# EasyEDA Pro project emergency-button.epro

# Schematic Schematic1
Board Name: Board1; Create Date: 2025-12-01; Page Name: P1; Project Name: Emergency Button; Schematic Name: Schematic1; Update Date: 2025-12-01; Company: EasyEDA.com; Page Size: A4; Version: V1.0
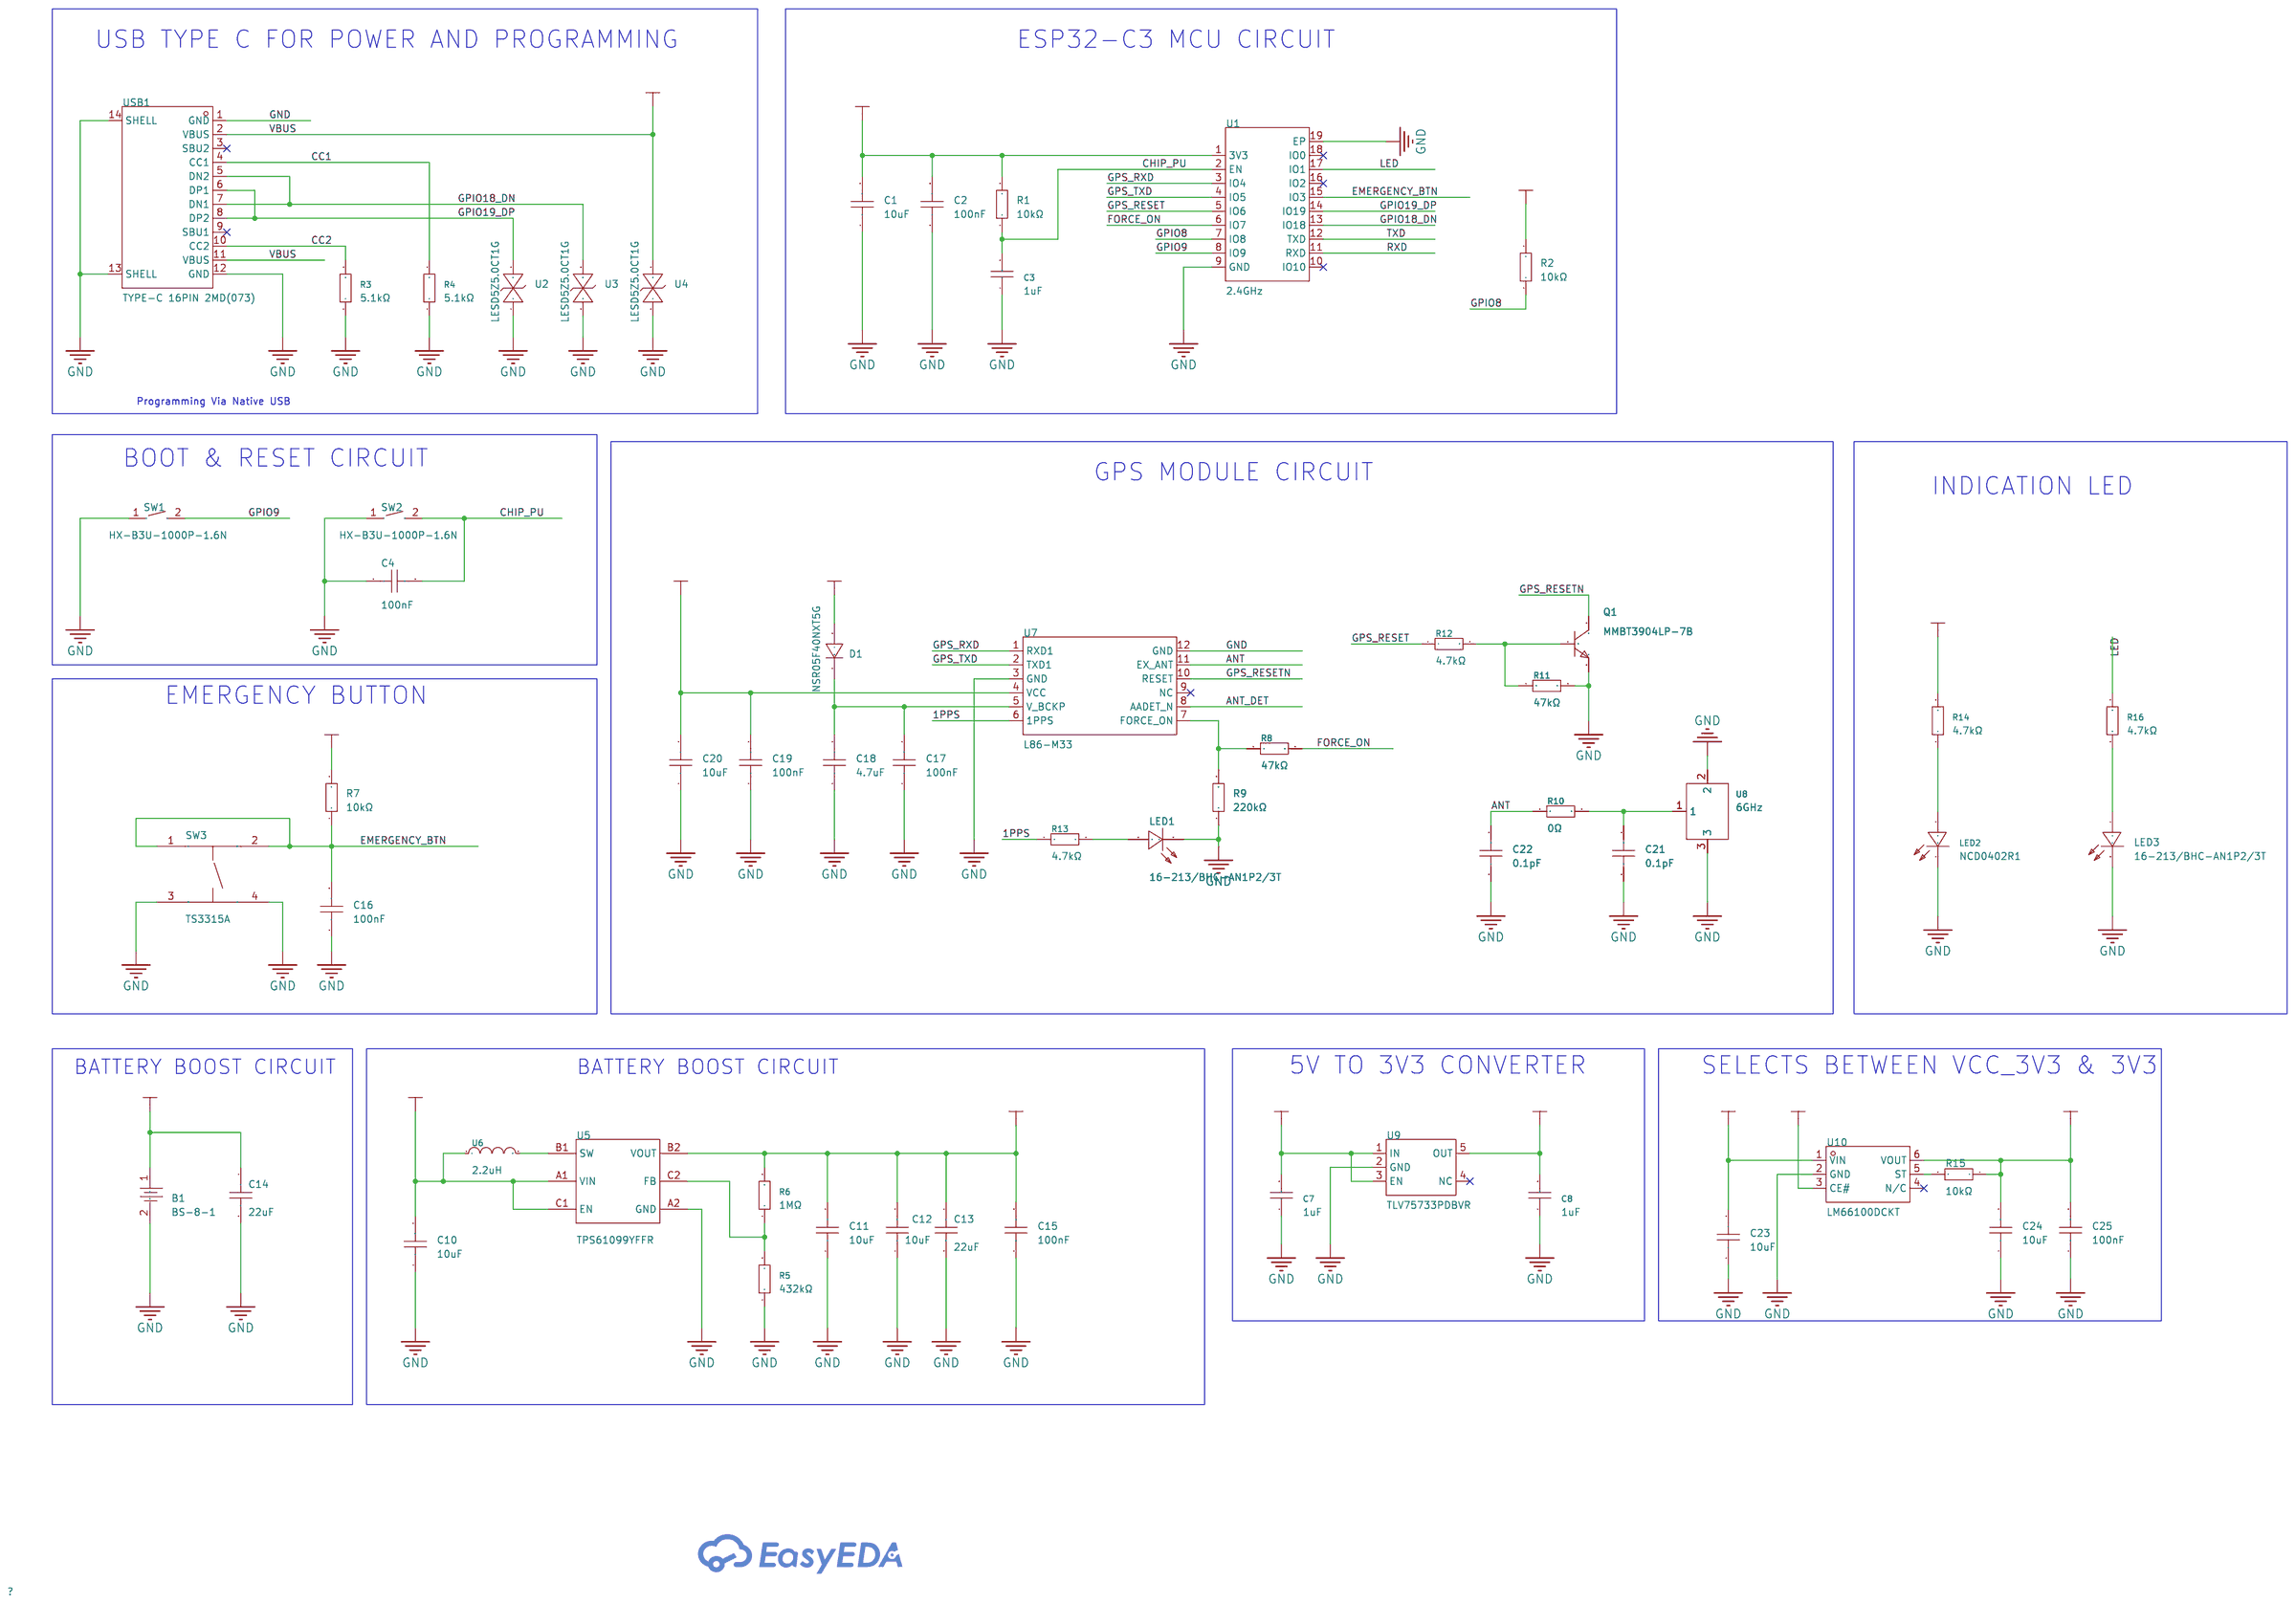
[diagram p0: schematic sheet]

## Parts
B1  BS-8-1  [BAT-TH_BS-8-1]
C1  10uF  [C0402]
C2  100nF  [C0402]
C3  1uF  [C0402]
C4  100nF  [C0402]
C7  1uF  [C0402]
C8  1uF  [C0402]
C10  10uF  [C0402]
C11  10uF  [C0402]
C12  10uF  [C0402]
C13  22uF  [C0603]
C14  22uF  [C0603]
C15  100nF  [C0402]
C16  100nF  [C0402]
C17  100nF  [C0402]
C18  4.7uF  [C0402]
C19  100nF  [C0402]
C20  10uF  [C0402]
C21  0.1pF  [C0402]
C22  0.1pF  [C0402]
C23  10uF  [C0402]
C24  10uF  [C0402]
C25  100nF  [C0402]
D1  NSR05F40NXT5G  [DSN2_L1.0-W0.6-RD]
LED1  16-213/BHC-AN1P2/3T  [LED0402-R-RD]
LED2  NCD0402R1  [LED0402-RD]
LED3  16-213/BHC-AN1P2/3T  [LED0402-R-RD]
Q1  MMBT3904LP-7B  [X1-DFN1006-3_L1.0-W0.6-BR]
R1  10kΩ  [R0402]
R2  10kΩ  [R0402]
R3  5.1kΩ  [R0402]
R4  5.1kΩ  [R0402]
R5  432kΩ  [R0402]
R6  1MΩ  [R0402]
R7  10kΩ  [R0402]
R8  47kΩ  [R0402]
R9  220kΩ  [R0402]
R10  0Ω  [R0402]
R11  47kΩ  [R0402]
R12  4.7kΩ  [R0402]
R13  4.7kΩ  [R0402]
R14  4.7kΩ  [R0402]
R15  10kΩ  [R0402]
R16  4.7kΩ  [R0402]
SW1  HX-B3U-1000P-1.6N  [SW-SMD_2P-L3.0-W2.5-LS4.0]
SW2  HX-B3U-1000P-1.6N  [SW-SMD_2P-L3.0-W2.5-LS4.0]
SW3  TS3315A  [SW-SMD_4P-L3.4-W3.4-P2.00-LS4.0]
U1  2.4GHz  [BULETM-SMD_ESPRESSIF_ESP32-C3-WROOM-02-N4-4MB]
U2  LESD5Z5.0CT1G  [SOD-523_L1.2-W0.8-LS1.6-BI]
U3  LESD5Z5.0CT1G  [SOD-523_L1.2-W0.8-LS1.6-BI]
U4  LESD5Z5.0CT1G  [SOD-523_L1.2-W0.8-LS1.6-BI]
U5  TPS61099YFFR  [DSBGA-6_L0.8-W1.2-P0.40-R3-C2-TL]
U6  2.2uH  [IND-SMD_L2.0-W1.6]
U7  L86-M33  [GPSM-SMD_12P-L16.0-W16.0-P2.54-BL]
U8  6GHz  [IPEX-SMD_BWIPX-1-001E]
U9  TLV75733PDBVR  [SOT-23-5_L2.9-W1.6-P0.95-LS2.8-BL]
U10  LM66100DCKT  [SC-70-6_L2.0-W1.3-P0.65-LS2.1-BL]
USB1  TYPE-C 16PIN 2MD(073)  [USB-C-SMD_TYPE-C-6PIN-2MD-073]

## Library data of the parts
B1 = BS-8-1: LCSC Part Name: 镀金 BS-8-1; Supplier Part: C70378; Manufacturer: QIJEY; Supplier Footprint: SMD; JLCPCB Part Class: Extended Part; Datasheet: https://item.szlcsc.com/datasheet/BS-8-1/71473.html; Supplier: LCSC
C1 C20 = CL05A106MP5NUNC_C315248: Capacitance:10uF Tolerance:±20% Tolerance:±20% Voltage Rating:10V Temperature Coefficient:X5R; LCSC Part Name: 10uF ±20% 10V; Supplier Part: C315248; Manufacturer: SAMSUNG(三星); Manufacturer Part: CL05A106MP5NUNC; Supplier Footprint: 0402; Datasheet: https://item.szlcsc.com/datasheet/CL05A106MP5NUNC/297154.html; Supplier: LCSC; Tolerance: ±20%; Voltage Rating: 10V; Temperature Coefficient: X5R
C2 C4 C15-C17 C19 C25 = CL05B104KB54PNC: Capacitance:100nF Tolerance:±10% Tolerance:±10% Voltage Rating:50V Temperature Coefficient:X7R; LCSC Part Name: 100nF ±10% 50V; Supplier Part: C307331; Manufacturer: SAMSUNG(三星); Supplier Footprint: 0402; Datasheet: https://item.szlcsc.com/datasheet/CL05B104KB54PNC/291005.html; Supplier: LCSC; Tolerance: ±10%; Voltage Rating: 50V; Temperature Coefficient: X7R
C3 C7 C8 = CL05A105KO5NNNC: Capacitance:1uF Tolerance:±10% Tolerance:±10% Voltage Rating:16V Temperature Coefficient:X5R; LCSC Part Name: 1uF ±10% 16V; Supplier Part: C29266; Manufacturer: SAMSUNG(三星); Supplier Footprint: 0402; Datasheet: https://item.szlcsc.com/datasheet/CL05A105KO5NNNC/30018.html; Supplier: LCSC; Tolerance: ±10%; Voltage Rating: 16V; Temperature Coefficient: X5R
C10-C12 C23 C24 = CL05A106MP5NUNC_C315248: Capacitance:10uF Tolerance:±20% Tolerance:±20% Voltage Rating:10V Temperature Coefficient:X5R; LCSC Part Name: 10uF ±20% 10V; Supplier Part: C315248; Manufacturer: SAMSUNG(三星); Manufacturer Part: CL05A106MP5NUNC; Supplier Footprint: 0402; JLCPCB Part Class: Extended Part; Datasheet: https://item.szlcsc.com/datasheet/CL05A106MP5NUNC/297154.html; Supplier: LCSC; Tolerance: ±20%; Voltage Rating: 10V; Temperature Coefficient: X5R
C13 C14 = CL10A226MO7JZNC: Capacitance:22uF Tolerance:±20% Tolerance:±20% Voltage Rating:16V Temperature Coefficient:X5R; LCSC Part Name: 22uF ±20% 16V; Supplier Part: C2762594; Manufacturer: SAMSUNG(三星); Supplier Footprint: 0603; Datasheet: https://item.szlcsc.com/datasheet/CL10A226MO7JZNC/2889856.html; Supplier: LCSC; Tolerance: ±20%; Voltage Rating: 16V; Temperature Coefficient: X5R
C18 = CL05A475MP5NRNC: Capacitance:4.7uF Tolerance:±20% Tolerance:±20% Voltage Rating:10V Temperature Coefficient:X5R; LCSC Part Name: 4.7uF ±20% 10V; Supplier Part: C23733; Manufacturer: SAMSUNG(三星); Supplier Footprint: 0402; Datasheet: https://item.szlcsc.com/datasheet/CL05A475MP5NRNC/24469.html; Supplier: LCSC; Tolerance: ±20%; Voltage Rating: 10V; Temperature Coefficient: X5R
C21 C22 = GJM1555C1HR10WB01D: Capacitance:0.1pF Voltage Rating:50V Temperature Coefficient:C0G; LCSC Part Name: ±0.05pF 0.1pF 50V; Supplier Part: C161338; Manufacturer: muRata(村田); Supplier Footprint: 0402; Datasheet: https://item.szlcsc.com/datasheet/GJM1555C1HR10WB01D/172719.html; Supplier: LCSC; Voltage Rating: 50V; Temperature Coefficient: C0G
D1 = NSR05F40NXT5G: Voltage - Forward(Vf@If):460mV@500mA Voltage - DC Reverse(Vr):40V Current - Rectified:500mA Reverse Leakage Current (Ir):75uA@40V Operating Junction Temperature Range:-40℃~+150℃ Operating Junction Temperature Range:-40℃~+150℃ Non-Repetitive Peak Forward S; LCSC Part Name: 电压:40V 电流:500mA; Supplier Part: C146713; Manufacturer: onsemi(安森美); Supplier Footprint: 0402; Datasheet: https://item.szlcsc.com/datasheet/NSR05F40NXT5G/158045.html; Supplier: LCSC; Voltage - Forward(Vf@If): 460mV@500mA; Voltage - DC Reverse(Vr): 40V; Current - Rectified: 500mA; Reverse Leakage Current (Ir): 75uA@40V; Operating Junction Temperature Range: -40℃~+150℃; Non-Repetitive Peak Forward Surge Current: 10A
LED1 LED3 = 16-213/BHC-AN1P2/3T: Illumination Color:Blue; LCSC Part Name: 蓝灯; Supplier Part: C131223; Manufacturer: EVERLIGHT(亿光); Supplier Footprint: 0402; Supplier: LCSC; Illumination Color: Blue
LED2 = NCD0402R1: Illumination Color:Red Voltage - Forward(Vf):1.6V~2.6V Voltage - Forward(Vf):1.6V~2.6V Power(Watts):65mW Forward Current:25mA Wavelength - Dominant:615nm~635nm Wavelength - Dominant:615nm~635nm Peak Wavelength:630nm Lens Color:- Luminous Intensity:30mcd L; LCSC Part Name: 片式发光二极管; Supplier Part: C130719; Manufacturer: 国星光电; Supplier Footprint: 0402; JLCPCB Part Class: Extended Part; Datasheet: https://item.szlcsc.com/datasheet/NCD0402R1/142008.html; Supplier: LCSC; Illumination Color: Red; Voltage - Forward(Vf): 1.6V~2.6V; Power(Watts): 65mW; Forward Current: 25mA; Wavelength - Dominant: 615nm~635nm; Peak Wavelength: 630nm; Luminous Intensity: 30mcd; Viewing Angle: 130°; Operating Temperature: -30℃~+85℃
Q1 = MMBT3904LP-7B: type:NPN Current - Collector(Ic):200mA Collector - Emitter Voltage VCEO:40V Pd - Power Dissipation:1W DC Current Gain:100@10mA,1.0V DC Current Gain:100@10mA,1.0V Transition frequency(fT):300MHz Current - Collector Cutoff:50nA Vce Saturation(VCE(sat)):300m; LCSC Part Name: NPN 电流:200mA 电压:40V; Supplier Part: C154763; Manufacturer: DIODES(美台); Supplier Footprint: DFN-3(1x0.6); Datasheet: https://item.szlcsc.com/datasheet/MMBT3904LP-7B/166105.html; Supplier: LCSC; type: NPN; Current - Collector(Ic): 200mA; Collector - Emitter Voltage VCEO: 40V; Pd - Power Dissipation: 1W; DC Current Gain: 100@10mA,1.0V; Transition frequency(fT): 300MHz; Current - Collector Cutoff: 50nA; Vce Saturation(VCE(sat)): 300mV@50mA,5mA; Operating Temperature: -55℃~+150℃; Emitter-Base Voltage(Vebo): 6V; Number: 1 NPN
R1 R2 R7 R15 = 0402WGF1002TCE: Type:Thick Film Resistor Resistance:10kΩ Tolerance:±1% Tolerance:±1% Power(Watts):62.5mW Voltage-Supply(Max):50V Temperature Coefficient:±100ppm/℃ Temperature Coefficient:±100ppm/℃ Operating Temperature:-55℃~+155℃ Operating Temperature:-55℃~+155℃; LCSC Part Name: 10kΩ ±1% 62.5mW 厚膜电阻; Supplier Part: C25744; Manufacturer: UNI-ROYAL(厚声); Supplier Footprint: 0402; Datasheet: https://item.szlcsc.com/datasheet/0402WGF1002TCE/26487.html; Supplier: LCSC; Type: Thick Film Resistor; Tolerance: ±1%; Power(Watts): 62.5mW; Voltage-Supply(Max): 50V; Temperature Coefficient: ±100ppm/℃; Operating Temperature: -55℃~+155℃
R3 R4 = 0402WGF5101TCE: Type:Thick Film Resistor Resistance:5.1kΩ Tolerance:±1% Tolerance:±1% Power(Watts):62.5mW Voltage-Supply(Max):50V Temperature Coefficient:±100ppm/℃ Temperature Coefficient:±100ppm/℃ Operating Temperature:-55℃~+155℃ Operating Temperature:-55℃~+155℃; LCSC Part Name: 5.1kΩ ±1% 62.5mW 厚膜电阻; Supplier Part: C25905; Manufacturer: UNI-ROYAL(厚声); Supplier Footprint: 0402; Datasheet: https://item.szlcsc.com/datasheet/0402WGF5101TCE/26648.html; Supplier: LCSC; Type: Thick Film Resistor; Tolerance: ±1%; Power(Watts): 62.5mW; Voltage-Supply(Max): 50V; Temperature Coefficient: ±100ppm/℃; Operating Temperature: -55℃~+155℃
R5 = 0402WGF4323TCE: Type:Thick Film Resistors Resistance:432kΩ Tolerance:±1% Tolerance:±1% Power(Watts): Overload Voltage (Max): Temperature Coefficient:±100ppm/℃ Temperature Coefficient:±100ppm/℃ Operating Temperature Range:-55℃~+155℃ Operating Temperature Range:-55℃~+155℃; LCSC Part Name: 432kΩ ±1% 62.5mW 厚膜电阻; Supplier Part: C25787; Manufacturer: UNI-ROYAL(厚声); Supplier Footprint: 0402; Datasheet: https://atta.szlcsc.com/upload/public/pdf/source/20200306/C422600_1E6D84923E4A46A82E41ADD87F860B5C.pdf; Supplier: LCSC; Type: Thick Film Resistors; Tolerance: ±1%; Temperature Coefficient: ±100ppm/℃; Operating Temperature Range: -55℃~+155℃
R6 = 0402WGF1004TCE: Type:Thick Film Resistor Resistance:1MΩ Tolerance:±1% Tolerance:±1% Power(Watts):62.5mW Voltage-Supply(Max):50V Temperature Coefficient:±100ppm/℃ Temperature Coefficient:±100ppm/℃ Operating Temperature:-55℃~+155℃ Operating Temperature:-55℃~+155℃; LCSC Part Name: 1MΩ ±1% 62.5mW 厚膜电阻; Supplier Part: C26083; Manufacturer: UNI-ROYAL(厚声); Supplier Footprint: 0402; Datasheet: https://item.szlcsc.com/datasheet/0402WGF1004TCE/26826.html; Supplier: LCSC; Type: Thick Film Resistor; Tolerance: ±1%; Power(Watts): 62.5mW; Voltage-Supply(Max): 50V; Temperature Coefficient: ±100ppm/℃; Operating Temperature: -55℃~+155℃
R8 R11 = 0402WGJ0473TCE: Type:Thick Film Resistors Resistance:47kΩ Tolerance:±5% Tolerance:±5% Power(Watts): Overload Voltage (Max): Temperature Coefficient:±100ppm/℃ Temperature Coefficient:±100ppm/℃ Operating Temperature Range:-55℃~+155℃ Operating Temperature Range:-55℃~+155℃; LCSC Part Name: 47kΩ ±5% 62.5mW 厚膜电阻; Supplier Part: C25563; Manufacturer: UNI-ROYAL(厚声); Supplier Footprint: 0402; Datasheet: https://atta.szlcsc.com/upload/public/pdf/source/20200306/C422600_1E6D84923E4A46A82E41ADD87F860B5C.pdf; Supplier: LCSC; Type: Thick Film Resistors; Tolerance: ±5%; Temperature Coefficient: ±100ppm/℃; Operating Temperature Range: -55℃~+155℃
R9 = 0402WGF2203TCE: Type:Thick Film Resistor Resistance:220kΩ Tolerance:±1% Tolerance:±1% Power(Watts):62.5mW Voltage-Supply(Max):50V Temperature Coefficient:±100ppm/℃ Temperature Coefficient:±100ppm/℃ Operating Temperature:-55℃~+155℃ Operating Temperature:-55℃~+155℃; LCSC Part Name: 220kΩ ±1% 62.5mW 厚膜电阻; Supplier Part: C25767; Manufacturer: UNI-ROYAL(厚声); Supplier Footprint: 0402; Datasheet: https://item.szlcsc.com/datasheet/0402WGF2203TCE/26510.html; Supplier: LCSC; Type: Thick Film Resistor; Tolerance: ±1%; Power(Watts): 62.5mW; Voltage-Supply(Max): 50V; Temperature Coefficient: ±100ppm/℃; Operating Temperature: -55℃~+155℃
R10 = 0402WGF0000TCE: Type:Thick Film Resistor Resistance:0Ω Tolerance:±1% Tolerance:±1% Power(Watts):62.5mW Voltage-Supply(Max):50V Temperature Coefficient:±800ppm/℃ Temperature Coefficient:±800ppm/℃ Operating Temperature:-55℃~+155℃ Operating Temperature:-55℃~+155℃; LCSC Part Name: 0Ω ±1% 62.5mW 厚膜电阻; Supplier Part: C17168; Manufacturer: UNI-ROYAL(厚声); Supplier Footprint: 0402; JLCPCB Part Class: Basic Part; Datasheet: https://item.szlcsc.com/datasheet/0402WGF0000TCE/17853.html; Supplier: LCSC; Type: Thick Film Resistor; Tolerance: ±1%; Power(Watts): 62.5mW; Voltage-Supply(Max): 50V; Temperature Coefficient: ±800ppm/℃; Operating Temperature: -55℃~+155℃
R12-R14 R16 = 0402WGF4701TCE: Type:Thick Film Resistor Resistance:4.7kΩ Tolerance:±1% Tolerance:±1% Power(Watts):62.5mW Voltage-Supply(Max):50V Temperature Coefficient:±100ppm/℃ Temperature Coefficient:±100ppm/℃ Operating Temperature:-55℃~+155℃ Operating Temperature:-55℃~+155℃; LCSC Part Name: 4.7kΩ ±1% 62.5mW 厚膜电阻; Supplier Part: C25900; Manufacturer: UNI-ROYAL(厚声); Supplier Footprint: 0402; Datasheet: https://item.szlcsc.com/datasheet/0402WGF4701TCE/26643.html; Supplier: LCSC; Type: Thick Film Resistor; Tolerance: ±1%; Power(Watts): 62.5mW; Voltage-Supply(Max): 50V; Temperature Coefficient: ±100ppm/℃; Operating Temperature: -55℃~+155℃
SW1 SW2 = HX-B3U-1000P-1.6N: Circuit:SPST Actuator Style:Round Button Operating Force:1.6N Mounting Type:Surface Mount,Vertical Length:3mm Width:2.5mm Switch Height:1.5mm with Bracket:Without Bracket Contact Current:50mA Voltage Rating:12V Actuator/Cap Color:Black With Lamp:No IP Rat; LCSC Part Name: 3*2.5*1.6mm 立贴 轻触开关; Supplier Part: C49234121; Manufacturer: hanxia(韩下); Supplier Footprint: SMD; Datasheet: https://item.szlcsc.com/datasheet/HX-B3U-1000P-1.6N/51650182.html; Supplier: LCSC; Circuit: SPST; Actuator Style: Round Button; Operating Force: 1.6N; Mounting Type: Surface Mount,Vertical; Length: 3mm; Width: 2.5mm; Switch Height: 1.5mm; with Bracket: Without Bracket; Contact Current: 50mA; Voltage Rating: 12V; Actuator/Cap Color: Black; With Lamp: No; Termination Style: SMD(SMT) Tab; Life: 100,000 Cycles
SW3 = TS3315A: Circuit:SPST Actuator Style:Round Button Operating Force:2.5N Mounting Type:Surface Mount,Vertical Length:3.3mm Width:3.3mm Switch Height:1.5mm with Bracket:- Contact Current:50mA Voltage Rating:12V Actuator/Cap Color:- With Lamp:- IP Rating:- Termination; LCSC Part Name: 3.3*3.3*1.5mm 立贴 轻触开关; Supplier Part: C412367; Manufacturer: SHOU HAN(首韩); Supplier Footprint: SMD,3.3x3.3mm; Datasheet: https://item.szlcsc.com/datasheet/TS3315A/404079.html; Supplier: LCSC; Circuit: SPST; Actuator Style: Round Button; Operating Force: 2.5N; Mounting Type: Surface Mount,Vertical; Length: 3.3mm; Width: 3.3mm; Switch Height: 1.5mm; Contact Current: 50mA; Voltage Rating: 12V; Life: 50,000 Cycles; Operating Temperature: -20℃~+70℃
U1 = ESP32-C3-WROOM-02-N4_C2934560: Core Processor:ESP32-C3芯片 Support Interface:I2C；GPIO；SPI；JTAG；UART；USB；I2S Frequency:2.4GHz Output Power:20.5dBm Output Power:20.5dBm; LCSC Part Name: ESP32-C3-WROOM-02-N4; Supplier Part: C2934560; Manufacturer: ESPRESSIF(乐鑫); Manufacturer Part: ESP32-C3-WROOM-02-N4; Supplier Footprint: VFQFN-32-EP; JLCPCB Part Class: Extended Part; Datasheet: https://atta.szlcsc.com/upload/public/pdf/source/20220106/F07459EFFE1D7CBA94B4FB8A075146A6.pdf; Supplier: LCSC; Core Processor: ESP32-C3芯片; Support Interface: I2C；GPIO；SPI；JTAG；UART；USB；I2S; Output Power: 20.5dBm
U2-U4 = LESD5Z5.0CT1G_C5451650: polarity:Bidirectional Reverse Stand-Off Voltage (Vrwm):5V Maximum Clamping Voltage:11.6V Peak Pulse Current (Ipp):9A Breakdown Voltage:7.8V Number of Lines:Single channel Type:ESD; LCSC Part Name: 5V 15PF 双向; Supplier Part: C5451650; Manufacturer: HXY MOSFET(华轩阳电子); Supplier Footprint: SOD-523; Datasheet: https://atta.szlcsc.com/upload/public/pdf/source/20230427/2F645B9D698C2F305680EBFB223778D0.pdf; Supplier: LCSC; polarity: Bidirectional; Reverse Stand-Off Voltage (Vrwm): 5V; Maximum Clamping Voltage: 11.6V; Peak Pulse Current (Ipp): 9A; Breakdown Voltage: 7.8V; Number of Lines: Single channel; Type: ESD
U5 = TPS61099YFFR: Function:Boost type Output Type:Adjustable Input Voltage:700mV~5.5V Input Voltage:700mV~5.5V Output Voltage:1.8V~5.5V Output Voltage:1.8V~5.5V Output Current:800mA Operating Temperature:-40℃~+125℃@(TJ) Operating Temperature:-40℃~+125℃@(TJ) Synchronous Rec; LCSC Part Name: TPS61099x超低静态电流同步升压转换器; Supplier Part: C91091; Manufacturer: TI(德州仪器); Supplier Footprint: DSBGA-6; Datasheet: https://www.ti.com/cn/lit/gpn/tps61099; Supplier: LCSC; Function: Boost type; Output Type: Adjustable; Input Voltage: 700mV~5.5V; Output Voltage: 1.8V~5.5V; Output Current: 800mA; Operating Temperature: -40℃~+125℃@(TJ); Synchronous Rectification: Yes; Number of Outputs: 1; Topology: Boost; Switch tube (built-in/external): Built-in
U6 = VLS201610CX-2R2M-1: Inductance:2.2uH Tolerance:±20% Tolerance:±20% Current Rating:1.31A Current - Saturation(Isat):1.31A DC Resistance(DCR):136mΩ Ratings:-; LCSC Part Name: 2.2uH ±20% 1.31A; Supplier Part: C2041554; Manufacturer: TDK; Supplier Footprint: 0806; JLCPCB Part Class: Extended Part; Datasheet: https://item.szlcsc.com/datasheet/VLS201610CX-2R2M-1/2133117.html; Supplier: LCSC; Tolerance: ±20%; Current Rating: 1.31A; Current - Saturation(Isat): 1.31A; DC Resistance(DCR): 136mΩ
U7 = L86-M33: Voltage - Supply:3V~4.3V Voltage - Supply:3V~4.3V Sensitivity:-167dBm Sensitivity:-167dBm Operating Temperature:-40℃~+85℃ Operating Temperature:-40℃~+85℃; LCSC Part Name: 超紧凑的GNSS POT模块; Supplier Part: C909689; Manufacturer: Quectel(移远); Supplier Footprint: SMD-12P; JLCPCB Part Class: Extended Part; Datasheet: https://item.szlcsc.com/datasheet/L86-M33/976784.html; Supplier: LCSC; Voltage - Supply: 3V~4.3V; Sensitivity: -167dBm; Operating Temperature: -40℃~+85℃
U8 = BWU.FL-IPEX1: Connector Type:Board Side Interface:Male Pin Number of Ports:1 Interface Diameter:2mm Interface Length/Height:1.25mm Frequency:6GHz RF Series:IPEX Impedance:50Ω Style:- Operating Temperature Range:- Operating Temperature Range:-; LCSC Part Name: 内针 IPEX; Supplier Part: C5137195; Manufacturer: BAT WIRELESS(蝙蝠无线); Supplier Footprint: SMD; Datasheet: https://item.szlcsc.com/datasheet/BWU.FL-IPEX1/5745892.html; Supplier: LCSC; Connector Type: Board Side; Interface: Male Pin; Number of Ports: 1; Interface Diameter: 2mm; Interface Length/Height: 1.25mm; RF Series: IPEX; Impedance: 50Ω
U9 = TLV75733PDBVR: Output Type:Fixed Maximum Input Voltage:5.5V Output Voltage:3.3V Output Voltage:3.3V Output Current:1A Power Supply Rejection Ratio (PSRR):52dB Dropout Voltage:475mV@(1A) Feature:ESD Protection；Surge Protection；Low ESR；Thermal Protection(TSD)；Under-voltag; LCSC Part Name: 具有使能功能的 1A、低 IQ、高精度、低压降稳压器; Supplier Part: C485517; Manufacturer: TI(德州仪器); Supplier Footprint: SOT-23-5; JLCPCB Part Class: Extended Part; Datasheet: https://www.ti.com/cn/lit/gpn/tlv757p; Supplier: LCSC; Output Type: Fixed; Maximum Input Voltage: 5.5V; Output Voltage: 3.3V; Output Current: 1A; Power Supply Rejection Ratio (PSRR): 52dB; Dropout Voltage: 475mV@(1A); Feature: ESD Protection；Surge Protection；Low ESR；Thermal Protection(TSD)；Under-voltage Lockout；Overcurrent Protection(OCP)；With ability; Operating Temperature: -40℃~+125℃@(Tj); Output Polarity: Positive electrode; Number of Outputs: 1
U10 = LM66100DCKT_C2832141: Maximum Continuous Current:1.5A Voltage - Supply:1.5V~5.5V Voltage - Supply:1.5V~5.5V Operating Temperature	-:-40℃~+105℃ Operating Temperature	-:-40℃~+105℃; Supplier Part: C2832141; Manufacturer: TI(德州仪器); Supplier Footprint: SC-70-6; JLCPCB Part Class: Extended Part; Datasheet: https://www.ti.com/cn/lit/gpn/lm66100; Supplier: LCSC; Maximum Continuous Current: 1.5A; Voltage - Supply: 1.5V~5.5V; Operating Temperature	-: -40℃~+105℃
USB1 = TYPE-C 16PIN 2MD(073): Connector Type:Type-C Protocol Standard:- Gender:Female Mounting Type:Surface Mount, Right Angle Number of Contacts:16P Number of Ports:1 Current Rating-Power:3A Voltage Rating:5V Connect-Disconnect Life:5,000 Cycles Supplementary Features:- Center Height; LCSC Part Name: Type-C 母 卧贴; Supplier Part: C2765186; Manufacturer: SHOU HAN(首韩); Supplier Footprint: SMD; JLCPCB Part Class: Extended Part; Datasheet: https://item.szlcsc.com/datasheet/TYPE-C%252016PIN%25202MD(073)/2901843.html; Supplier: LCSC; Connector Type: Type-C; Gender: Female; Mounting Type: Surface Mount, Right Angle; Number of Contacts: 16P; Number of Ports: 1; Current Rating-Power: 3A; Voltage Rating: 5V; Connect-Disconnect Life: 5,000 Cycles; Detection color: Black; Operating Temperature: -25℃~+85℃

## Nets
3V3: C1.2 C2.2 C11.2 C12.2 C13.1 C15.2 C19.2 C20.2 C24.2 C25.2 D1.2(A) R1.2 R2.2 R6.2 R7.2 R15.1 U1.1(3V3) U5.B2(VOUT) U7.4(VCC) U10.3(CE#) U10.6(VOUT)
GND: B1.2 C1.1 C2.1 C3.1 C4.1 C7.1 C8.1 C10.1 C11.1 C12.1 C13.2 C14.2 C15.1 C16.1 C17.1 C18.1 C19.1 C20.1 C21.2 C22.2 C23.1 C24.1 C25.1 LED1.2(K) LED2.1(K) LED3.2(K) Q1.2(E) R3.1 R4.1 R5.1 R9.1 R11.2 SW1.1 SW2.1 SW3.3(C) SW3.4(D) U1.9(GND) U1.19(EP) U2.1 U3.1 U4.1 U5.A2(GND) U7.3(GND) U7.12(GND) U8.2 U8.3 U9.2(GND) U10.2(GND) USB1.1(GND) USB1.12(GND) USB1.13(SHELL) USB1.14(SHELL)
VBUS: C7.2 R14.2 U4.2 U9.1(IN) U9.3(EN) USB1.2(VBUS) USB1.11(VBUS)
VCC_3V3: C8.2 C23.2 U9.5(OUT) U10.1(VIN)
1PPS: R13.1 U7.6(1PPS)
ANT: C22.1 R10.1 U7.11(EX_ANT)
ANT_DET: U7.8(AADET_N)
BAT+: B1.1 C10.2 C14.1 U5.A1(VIN) U5.C1(EN) U6.1
CC1: R4.2 USB1.4(CC1)
CC2: R3.2 USB1.10(CC2)
CHIP_PU: C3.2 C4.2 R1.1 SW2.2 U1.2(EN)
EMERGENCY_BTN: C16.2 R7.1 SW3.1(A) SW3.2(B) U1.15(IO3)
FORCE_ON: R8.2 U1.6(IO7)
GPIO8: R2.1 U1.7(IO8)
GPIO9: SW1.2 U1.8(IO9)
GPIO18_DN: U1.13(IO18) U3.2 USB1.5(DN2) USB1.7(DN1)
GPIO19_DP: U1.14(IO19) U2.2 USB1.6(DP1) USB1.8(DP2)
GPS_RESET: R12.1 U1.5(IO6)
GPS_RESETN: Q1.3(C) U7.10(RESET)
GPS_RXD: U1.3(IO4) U7.1(RXD1)
GPS_TXD: U1.4(IO5) U7.2(TXD1)
LED: R16.1 U1.17(IO1)
RXD: U1.11(RXD)
TXD: U1.12(TXD)
$1N1386: R5.2 R6.1 U5.C2(FB)
$1N1393: U5.B1(SW) U6.2
$1N2307: C17.2 C18.2 D1.1(C) U7.5(V_BCKP)
$1N2753: R8.1 R9.2 U7.7(FORCE_ON)
$1N3030: C21.1 R10.2 U8.1
$1N3469: Q1.1(B) R11.1 R12.2
$1N3602: LED1.1(A) R13.2
$1N4272: R15.2 U10.5(ST)
$1N4446: LED2.2(A) R14.1
$1N4523: LED3.1(A) R16.2

Not connected (* = marked no-connect by the designer): U1 10(IO10)* 16(IO2)* 18(IO0)*; U7 9(NC)*; U9 4(NC)*; U10 4(N/C)*; USB1 3(SBU2)* 9(SBU1)*

## Notes on the sheet
- USB TYPE C FOR POWER AND PROGRAMMING
- ESP32-C3 MCU CIRCUIT
- Programming Via Native USB
- BOOT & RESET CIRCUIT
- GPS MODULE CIRCUIT
- INDICATION LED
- EMERGENCY BUTTON
- BATTERY BOOST CIRCUIT
- BATTERY BOOST CIRCUIT
- 5V TO 3V3 CONVERTER
- SELECTS BETWEEN VCC_3V3 & 3V3

# Board PCB1
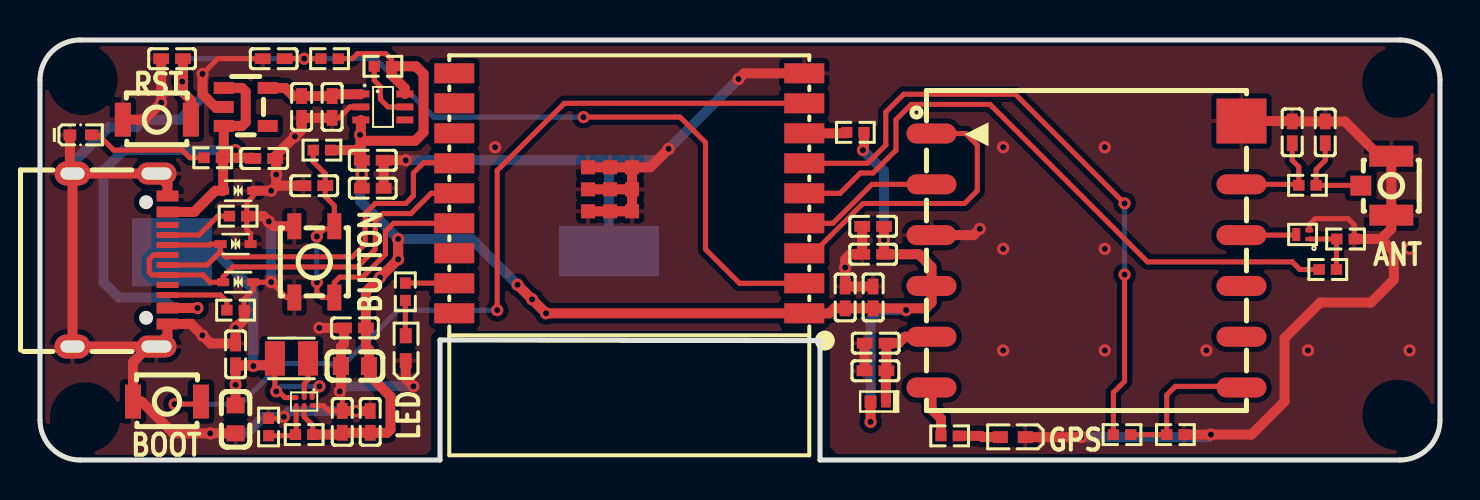
[diagram p1: board, top side]
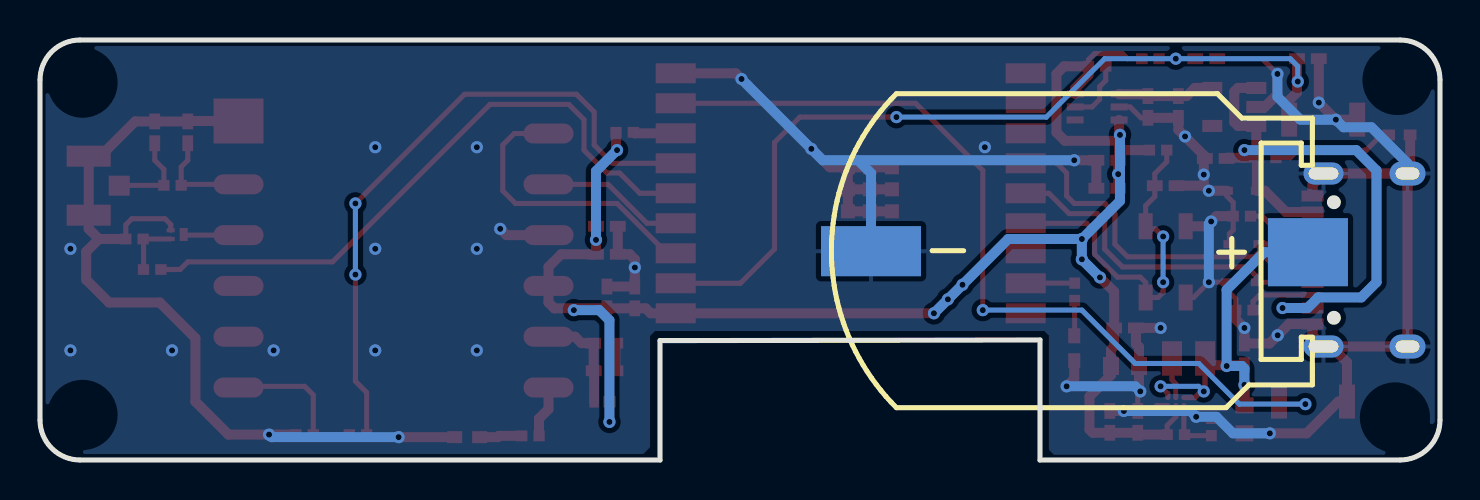
[diagram p2: board, bottom side, seen from below]

Outline 70 x 21 mm; copper layers: Top Layer, Bottom Layer. Coordinates in mm from the lower left corner of the outline.
Outline path: 0,19 0,2 arc(0.59,0.59) 2,0 20,0 20,6 39,5.97 39,0 68,0 arc(69.41,0.59) 70,2 70,19 arc(69.42,20.41) 68,21 2,21 arc(0.59,20.41) 0,19
Stack: Top Layer 0.035mm / Dielectric1 1.51mm FR4 er 4.5 / Bottom Layer 0.035mm

## Design rules (mm)
template: JLCPCB Capability(Two Layers Board)
spacing copperThickness1oz (default): track to track 0.102, other pairs 0.152 to 0.3
spacing copperThickness2oz: track to track 0.203, other pairs 0.152 to 0.3
track width copperThickness1oz (default): min 0.127, default 0.254, max 2.54
track width copperThickness2oz: min 0.203, default 0.254, max 2.54
differential pair differentialPair (default): width min 0.127, default 0.254, max 2.54; gap min 0.152, default 0.152
via viaSize (default): diameter min 0.5, default 0.61, max 10; hole min 0.3, default 0.305, max 6.3

## Placement (name value [footprint] x y rotation side)
B1  BS-8-1  [BAT-TH_BS-8-1]  17.53 10.41 0 bottom
C1  10uF  [C0402]  41.66 8.13 270 top
C2  100nF  [C0402]  40.26 8.13 270 top
C3  1uF  [C0402]  11.68 20.07 0 top
C4  100nF  [C0402]  6.6 20.07 0 top
C7  1uF  [C0402]  11.21 15.08 180 top
C8  1uF  [C0402]  13.08 17.65 90 top
C10  10uF  [C0402]  9.78 5.28 270 top
C11  10uF  [C0402]  15.11 1.91 270 top
C12  10uF  [C0402]  16.51 1.91 270 top
C13  22uF  [C0603]  15.75 4.7 180 top
C14  22uF  [C0603]  9.78 2.03 270 top
C15  100nF  [C0402]  15.75 6.6 0 top
C16  100nF  [C0402]  13.72 13.72 0 top
C17  100nF  [C0402]  41.77 4.46 0 top
C18  4.7uF  [C0402]  41.78 5.84 0 top
C19  100nF  [C0402]  41.66 11.68 0 top
C20  10uF  [C0402]  41.66 10.29 0 top
C21  0.1pF  [C0402]  64.26 16.38 90 top
C22  0.1pF  [C0402]  62.61 16.38 90 top
C23  10uF  [C0402]  14.61 17.65 90 top
C24  10uF  [C0402]  16.64 14.99 180 top
C25  100nF  [C0402]  16.64 13.59 180 top
D1  NSR05F40NXT5G  [DSN2_L1.0-W0.6-RD]  41.91 2.92 180 top
LED1  16-213/BHC-AN1P2/3T  [LED0402-R-RD]  48.64 1.14 180 top
LED2  NCD0402R1  [LED0402-RD]  2.03 16.26 0 top
LED3  16-213/BHC-AN1P2/3T  [LED0402-R-RD]  18.29 5.59 90 top
Q1  MMBT3904LP-7B  [X1-DFN1006-3_L1.0-W0.6-BR]  63.14 11.27 0 top
R1  10kΩ  [R0402]  14.48 20.07 0 top
R2  10kΩ  [R0402]  40.77 16.38 0 top
R3  5.1kΩ  [R0402]  9.78 7.49 180 top
R4  5.1kΩ  [R0402]  9.91 12.19 180 top
R5  432kΩ  [R0402]  11.43 1.65 270 top
R6  1MΩ  [R0402]  13.21 1.27 0 top
R7  10kΩ  [R0402]  14.1 15.49 0 top
R8  47kΩ  [R0402]  54.1 1.27 180 top
R9  220kΩ  [R0402]  56.77 1.27 180 top
R10  0Ω  [R0402]  63.37 13.73 0 top
R11  47kΩ  [R0402]  65.28 11.05 0 top
R12  4.7kΩ  [R0402]  64.39 9.53 0 top
R13  4.7kΩ  [R0402]  45.48 1.2 0 top
R14  4.7kΩ  [R0402]  8.64 15.11 0 top
R15  10kΩ  [R0402]  17.14 19.69 180 top
R16  4.7kΩ  [R0402]  18.27 8.41 270 top
SW1  HX-B3U-1000P-1.6N  [SW-SMD_2P-L3.0-W2.5-LS4.0]  6.35 2.92 180 top
SW2  HX-B3U-1000P-1.6N  [SW-SMD_2P-L3.0-W2.5-LS4.0]  5.84 17.02 180 top
SW3  TS3315A  [SW-SMD_4P-L3.4-W3.4-P2.00-LS4.0]  13.72 9.91 270 top
U1  2.4GHz  [BULETM-SMD_ESPRESSIF_ESP32-C3-WROOM-02-N4-4MB]  29.46 13.33 180 top
U2  LESD5Z5.0CT1G  [SOD-523_L1.2-W0.8-LS1.6-BI]  9.91 8.89 180 top
U3  LESD5Z5.0CT1G  [SOD-523_L1.2-W0.8-LS1.6-BI]  9.78 10.8 180 top
U4  LESD5Z5.0CT1G  [SOD-523_L1.2-W0.8-LS1.6-BI]  9.91 13.46 180 top
U5  TPS61099YFFR  [DSBGA-6_L0.8-W1.2-P0.40-R3-C2-TL]  13.21 2.92 270 top
U6  2.2uH  [IND-SMD_L2.0-W1.6]  12.57 5.08 180 top
U7  L86-M33  [GPSM-SMD_12P-L16.0-W16.0-P2.54-BL]  52.32 10.29 270 top
U8  6GHz  [IPEX-SMD_BWIPX-1-001E]  66.8 13.72 0 top
U9  TLV75733PDBVR  [SOT-23-5_L2.9-W1.6-P0.95-LS2.8-BL]  10.29 17.65 270 top
U10  LM66100DCKT  [SC-70-6_L2.0-W1.3-P0.65-LS2.1-BL]  17.14 17.65 270 top
USB1  TYPE-C 16PIN 2MD(073)  [USB-C-SMD_TYPE-C-6PIN-2MD-073]  4 10 270 top

## Footprints (pads in the part's own frame, mm; a bottom-side part is the same pattern mirrored in y, then rotated)
BAT-TH_BS-8-1
  rect 4x3.4 smd: 1(-10.922,0.025)
  rect 5x2.5 smd: 2(10.922,-0.025)
BULETM-SMD_ESPRESSIF_ESP32-C3-WROOM-02-N4-4MB
  rect 2x1 smd: 1(-8.75,6) 2(-8.75,4.5) 3(-8.75,3) 4(-8.75,1.5) 5(-8.75,0) 6(-8.75,-1.5) 7(-8.75,-3) 8(-8.75,-4.5) 9(-8.75,-6) 10(8.75,-6) 11(8.75,-4.5) 12(8.75,-3) 13(8.75,-1.5) 14(8.75,0) 15(8.75,1.5) 16(8.75,3) 17(8.75,4.5) 18(8.75,6)
  rect 0.7x0.7 smd: 19(-0.14,0.9) 19(-0.14,-0.2) 19(-0.14,-1.3) 19(0.96,0.9) 19(0.96,-0.2) 19(0.96,-1.3) 19(2.06,0.9) 19(2.06,-0.2) 19(2.06,-1.3)
C0402
  rect 0.79x0.54 smd: 1(-0.545,0) 2(0.545,0)
C0603
  rect 0.8x0.9 smd: 1(-0.7,0) 2(0.7,0)
DSBGA-6_L0.8-W1.2-P0.40-R3-C2-TL
  round 0.2 smd: A1(-0.201,0.4) A2(0.201,0.4) B1(-0.201,0.002) B2(0.201,-0.002) C1(-0.201,-0.4) C2(0.201,-0.4)
DSN2_L1.0-W0.6-RD
  rect 0.47x0.6 smd: 1(-0.383,0)
  rect 0.6x0.6 smd: 2(0.383,0)
GPSM-SMD_12P-L16.0-W16.0-P2.54-BL
  oval 1x2.5 smd: 1(-6.037,-7.75) 2(-3.498,-7.75) 3(-0.958,-7.75) 4(1.583,-7.75) 5(4.122,-7.75) 6(6.662,-7.75) 7(6.662,7.75) 8(4.122,7.75) 9(1.583,7.75) 10(-0.958,7.75) 11(-3.498,7.75)
  rect 2.25x2.5 smd: 12(-6.662,7.75)
IND-SMD_L2.0-W1.6
  rect 1x1.72 smd: 1(0.828,0) 2(-0.828,0)
IPEX-SMD_BWIPX-1-001E
  rect 1.05x1 smd: 1(-0.762,0)
  rect 2.2x1.05 smd: 2(0.762,-1.475) 3(0.762,1.475)
LED0402-R-RD
  rect 0.75x0.6 smd: 1(0.623,0) 2(-0.623,0)
LED0402-RD
  rect 0.636x0.54 smd: 1(-0.538,0) 2(0.538,0)
R0402
  rect 0.566x0.54 smd: 1(-0.433,0) 2(0.433,0)
SC-70-6_L2.0-W1.3-P0.65-LS2.1-BL
  rect 0.35x0.85 smd: 1(-0.65,-1.1) 2(0,-1.1) 3(0.65,-1.1) 4(0.65,1.1) 5(0,1.1) 6(-0.65,1.1)
SOD-523_L1.2-W0.8-LS1.6-BI
  rect 0.6x0.4 smd: 1(-0.75,0) 2(0.75,0)
SOT-23-5_L2.9-W1.6-P0.95-LS2.8-BL
  rect 0.6x1 smd: 1(-0.95,-1.1) 2(0,-1.1) 3(0.95,-1.1) 4(0.95,1.1) 5(-0.95,1.1)
SW-SMD_2P-L3.0-W2.5-LS4.0
  rect 0.8x1.7 smd: 1(1.7,0) 2(-1.7,0)
SW-SMD_4P-L3.4-W3.4-P2.00-LS4.0
  rect 1.3x0.7 smd: 1(-1.782,1) 2(1.782,1) 3(-1.782,-1) 4(1.782,-1)
USB-C-SMD_TYPE-C-6PIN-2MD-073
  rect 0.55x1.1 smd: 1(-3.2,2.375) 2(-2.4,2.375) 11(2.4,2.375) 12(3.2,2.375)
  rect 0.3x1.1 smd: 3(-1.75,2.375) 4(-1.25,2.375) 5(-0.75,2.375) 6(-0.25,2.375) 7(0.25,2.375) 8(0.75,2.375) 9(1.25,2.375) 10(1.75,2.375)
  oval 1.1x2 hole 0.6x1.5: 13(-4.325,1.825) 14(4.325,1.825)
  oval 1.2x1.8 hole 0.6x1.2: 13(-4.325,-2.375) 14(4.325,-2.375)
X1-DFN1006-3_L1.0-W0.6-BR
  rect 0.4x0.2 smd: 1(0.325,-0.217) 2(0.325,0.217)
  rect 0.4x0.65 smd: 3(-0.325,0.007)

## Nets
As in the schematic.

Pads without a net: U1 10 16 18; U7 9; U9 4; U10 4; USB1 3 9

## Via types
v1: diameter 0.61, hole 0.305, Top Layer to Bottom Layer, 61 vias

## Routing (per net, layer and track width the routed paths; a pad name or vN(x,y) marks a point on that pad's centre or on a via; arc(x,y) is an arc through that point)
3V3: length 92.4
  Top Layer w0.254: R15.1 17.58,20.01 17.27,20.32 15.88,20.32 15.62,20.07 R1.2 ; v1(16,16.26) 16.01,16.26 16.05,16.22 ; 13.21,2.72 13.21,2.16 13.64,1.73 R6.2
  Top Layer w0.5: D1.2 v1(41.53,1.91) ; v1(23.88,8.76) v1(24.61,8.03) v1(25.3,7.33) U1.1 39.47,7.33 39.71,7.58 C2.2 C1.2 44.29,7.58 44.58,7.87 44.58,8.7 U7.4 44.57,9.66 43.94,10.29 C20.2 v1(42.2,11.01) C19.2 ; R7.2 15.82,15.49 16.05,15.72 ; 16.05,15.72 16.05,15.96 18.75,15.96 19.18,16.38 19.18,19.3 18.8,19.69 R15.1 17.58,19.25 18.25,18.58 U10.6 ; 16.05,15.72 16.05,15.03 C24.2 v1(16.09,14.29) C25.2 ; v1(17.91,11.05) v1(17.91,10.03) v1(17,9.13) 16.29,8.42 C15.2 16.29,5.68 16.45,5.52 C13.1 16.45,4.25 17.53,3.17 17.53,1.52 17.36,1.36 C12.2 C11.2 15.02,1.27 R6.2 ; 16.05,16.22 U10.3 ; v1(41.15,15.49) 41.2,15.55 R2.2
  Bottom Layer w0.5: 17.02,9.14 v1(17.91,10.03) v1(17.91,11.05) ; 25.27,7.37 v1(24.61,8.03) v1(23.88,8.76) 21.59,11.05 v1(17.91,11.05) ; v1(43.31,7.49) 42.04,7.49 41.53,6.98 v1(41.53,1.91) ; v1(17.91,11.05) 16,12.95 v1(16,16.26) ; v1(42.2,11.01) 42.2,14.44 v1(41.15,15.49)
GND: length 193.8
  Top Layer w0.254: Q1.2 63.46,11.77 63.75,12.06 65.41,12.06 65.71,11.76 65.71,11.05 ; C23.1 14.95,17.11 15.49,17.65 U10.2 ; C3.1 8.89,20.07 v1(8.13,19.3) ; v1(14.99,3.43) 15.11,3.3 C11.1 14.44,2.45 14.17,2.72 U5.A2 ; SW3.4 12.32,8.12 v1(11.56,8.89) U2.1 10.66,8.5 10.21,8.05 R3.1 ; U4.1 10.66,13.2 10.34,12.88 R4.1 10.34,11.5 10.53,11.31 U3.1 ; v1(12.19,2.16) 12.12,2.08 R5.1
  Top Layer w0.5: C18.1 41.23,5.83 C17.1 ; U4.1 v1(11.56,13.46) 11.81,13.72 ; USB1.1 6.38,13.78 USB1.13 USB1.13 ; 27.4,12.44 29.6,12.44 U1.19 ; 67.06,11.05 67.69,10.41 67.69,9.02 66.55,7.87 64.01,7.87 62.23,6.1 62.23,2.92 60.58,1.27 v1(58.55,1.27) R9.1 ; 67.06,11.05 67.56,11.56 U8.2 67.56,15.19 66.98,15.19 65.24,16.93 C21.2 C22.2 62.59,16.95 U7.12 ; 67.06,11.05 65.71,11.05 ; v1(34.93,19.05) 35.21,19.33 U1.9 ; C23.1 C8.1 13.08,16.51 v1(12.75,16.18) 11.76,15.19 C7.1 11.81,15.02 v1(11.81,14.27) 11.81,13.72 ; U1.19 U1.19 U1.19 ; v1(8.13,19.3) 8.13,18.29 8.76,17.65 U9.2 ; USB1.13 1.49,14.46 LED2.1 ; USB1.13 USB1.14 5.44,5.67 4.65,4.89 SW1.1 5.08,2.92 6.67,1.33 v1(8.51,1.33) C14.2 ; 29.6,14.64 27.4,14.64 ; 29.6,14.64 30.51,14.64 v1(31.43,15.56) ; 29.6,14.64 U1.19 ; SW2.1 v1(5.21,17.02) v1(6.06,17.87) C4.1 ; C25.1 C24.1 v1(18.29,14.99) ; C1.1 C2.1 v1(40.26,9.62) 40.26,10.03 40.51,10.29 C20.1 C19.1 ; LED1.2 v1(52.07,1.14) ; v1(18.67,3.68) 18.29,4.06 LED3.2 ; C12.1 v1(15.81,2.45) C11.1 ; USB1.14 6.38,6.22 USB1.12 7.55,6.8 v1(8.12,6.23) 8.52,5.83 C10.1 v1(9.78,6.6) 10.21,7.04 R3.1 ; 11.81,13.72 13.17,13.72 ; SW3.3 11.68,11.69 v1(11.44,11.93) 11.18,12.19 R4.1 ; U7.3 46.68,11.24 v1(46.99,11.56) ; v1(13.97,6.6) C15.1 15.2,5.81 15.05,5.65 C13.2 15.05,3.49 v1(14.99,3.43)
  Bottom Layer w0.5: 29.1,14.99 30.86,14.99 v1(31.43,15.56) v1(34.93,19.05) ; 29.1,14.99 28.45,14.34 B1.2 ; 29.1,14.99 v1(18.29,14.99) ; v1(15.81,2.45) 12.48,2.45 v1(12.19,2.16) 11.18,2.16 10.35,1.33 v1(8.51,1.33) ; v1(58.55,1.27) 58.42,1.14 v1(52.07,1.14) ; v1(14.99,3.43) 15.24,3.68 v1(18.67,3.68) ; USB1.13 1.62,14.83 3.43,16.64 4.83,16.64 v1(5.21,17.02) 6.98,17.02 8.13,18.16 v1(8.13,19.3) ; v1(11.56,8.89) 11.56,11.81 v1(11.44,11.93)
  vias: v1(22.76,15.64) v1(48.16,15.64) v1(48.16,10.56) v1(48.16,5.48) v1(53.24,15.64) v1(53.24,10.56) v1(53.24,5.48) v1(58.32,5.48) v1(63.4,5.48) v1(68.48,10.56) v1(68.48,5.48)
VBUS: length 31.8
  Top Layer w0.5: C7.2 10.63,15.11 9.81,15.11 ; USB1.2 7.7,12.4 8.76,13.46 U4.2 9.16,15.03 R14.2 ; USB1.11 v1(7.87,7.6) ; R14.2 9.81,15.11 ; R14.2 9.19,15.23 U9.3 10.1,16.7 10.29,16.89 10.29,18.42 10.1,18.6 U9.1 ; 9.81,15.11 9.81,15.46 v1(9.78,15.49)
  Bottom Layer w0.5: v1(7.87,7.6) 6.62,7.6 6.1,8.13 3.94,8.13 3.17,8.89 3.17,14.48 4.19,15.49 v1(9.78,15.49)
VCC_3V3: length 4.9
  Top Layer w0.5: U9.5 12.26,18.6 12.66,18.2 C8.2 C23.2 14.69,18.29 16.03,18.29 U10.1
1PPS: length 2.6
  Top Layer w0.5: U7.6 44.57,2.54 45.05,2.07 R13.1
ANT: length 5.1
  Top Layer w0.254: C22.1 62.61,14.99 62.94,14.66 R10.1 62.89,13.78 U7.11
BAT+: length 20.4
  Top Layer w0.254: 11.75,3.62 U6.1 ; 11.75,3.62 12.25,3.12 U5.C1 ; 11.75,3.62 11.75,3.5 v1(11.81,3.43) ; U5.A1 13.61,3.32 v1(13.97,3.68)
  Top Layer w0.5: U6.1 11.4,4.74 C10.2 v1(9.78,3.76) C14.1
  Bottom Layer w0.254: v1(13.97,3.68) 12.06,3.68 v1(11.81,3.43)
  Bottom Layer w0.5: v1(9.78,3.76) 9.78,4.57 9.91,4.7 v1(10.67,4.7) 10.67,8.51 8.79,10.39 B1.1
CC1: length 3.5
  Top Layer w0.254: USB1.4 7.95,11.25 8.89,12.19 R4.2
CC2: length 3.5
  Top Layer w0.254: R3.2 9.35,7.93 9.02,8.25 USB1.10
CHIP_PU: length 44.9
  Top Layer w0.254: R1.1 v1(13.21,20.07) C3.2 ; U1.2 34.98,8.83 33.27,10.54 33.27,15.88 32,17.14 v1(27.18,17.14) ; 7.11,18.91 7.15,18.87
  Top Layer w0.5: SW2.2 7.54,17.98 7.15,18.38 C4.2
  Bottom Layer w0.254: v1(27.18,17.14) 19.69,17.14 16.76,20.07 v1(13.21,20.07) 7.49,20.07 7.11,19.69 v1(7.11,18.92)
EMERGENCY_BTN: length 17.7
  Top Layer w0.254: v1(13.84,8.89) 13.84,8.38 14.1,8.12 SW3.2 14.72,8.87 14.99,9.14 16.13,9.14 17.27,10.29 17.27,11.43 17.68,11.83 U1.15 ; v1(13.84,11.18) 14.22,11.56 14.58,11.56 SW3.1 14.72,12.72 14.26,13.17 C16.2 14.26,14.31 13.66,14.91 R7.1
  Bottom Layer w0.254: v1(13.84,11.18) v1(13.84,8.89)
FORCE_ON: length 32.5
  Top Layer w0.254: R8.2 53.67,3.38 54.23,3.94 v1(54.23,9.27) ; U1.6 41.38,14.83 42.29,15.75 42.29,17.4 43.18,18.29 48.77,18.29 v1(54.23,12.83)
  Bottom Layer w0.254: v1(54.23,12.83) v1(54.23,9.27)
GPIO8: length 2.1
  Top Layer w0.5: R2.1 40.29,16.33 U1.7
GPIO9: length 43.2
  Top Layer w0.254: SW1.2 7.92,2.79 v1(6.73,2.79) ; v1(22.86,7.49) 22.86,14.48 26.22,17.83 U1.8
  Bottom Layer w0.254: v1(6.73,2.79) 10.03,2.79 12.06,4.83 15.24,4.83 17.91,7.49 v1(22.86,7.49)
GPIO18_DN: length 21.3
  Top Layer w0.254: 9.02,10.41 8.35,9.75 USB1.7 ; 9.02,10.41 9.02,10.78 U3.2 8.51,10.8 8.46,10.75 USB1.5 ; 9.02,10.41 9.27,10.16 15.62,10.16 16.26,10.8 16.26,12.32 16.76,12.83 18.29,12.83 18.67,13.21 18.67,14.35 19.18,14.86 20.69,14.86 U1.13
GPIO19_DP: length 19.9
  Top Layer w0.254: U1.14 19.56,13.33 18.54,12.32 17.14,12.32 16.76,11.94 16.76,10.54 15.88,9.65 9.65,9.65 9.16,9.16 U2.2 8.51,8.89 8.15,9.25 USB1.8 5.61,9.25 5.46,9.4 5.46,10.03 5.68,10.25 USB1.6
GPS_RESET: length 31.9
  Top Layer w0.254: U1.5 40,13.33 41.02,14.35 41.66,14.35 42.8,15.49 42.8,17.02 43.56,17.78 47.5,17.78 55.37,9.91 62.61,9.91 62.99,9.53 R12.1
GPS_RESETN: length 2.8
  Top Layer w0.254: Q1.3 62.78,11.24 U7.10
GPS_RXD: length 14.8
  Top Layer w0.254: U1.3 38.65,10.33 41.14,12.83 46.23,12.83 46.86,13.46 46.86,15.75 46.29,16.32 U7.1
GPS_TXD: length 7.2
  Top Layer w0.254: U1.4 39.65,11.83 41.6,13.78 U7.2
LED: length 2.5
  Top Layer w0.254: R16.1 20.71,8.84 U1.17
$1N1386: length 2.8
  Top Layer w0.254: U5.C2 12.81,1.3 12.78,1.27 12.72,1.22 R5.2
$1N1393: length 2
  Top Layer w0.254: U5.B1 13.21,3.81 13.4,4 U6.2
$1N2307: length 5.3
  Top Layer w0.5: D1.1 42.29,4.44 C17.2 42.32,5.83 C18.2 42.93,5.84 43.25,6.16 U7.5
$1N2753: length 7.7
  Top Layer w0.254: U7.7 60.02,3.68 56.77,3.68 56.34,3.25 R9.2 R8.1
$1N3030: length 4.5
  Top Layer w0.254: U8.1 66.02,13.73 R10.2 63.81,14.53 64.26,14.99 C21.1
$1N3469: length 2.9
  Top Layer w0.254: Q1.1 64.84,11.05 R11.1 64.82,11.03 R12.2
$1N3602: length 2.1
  Top Layer w0.5: R13.2 47.06,1.2 47.12,1.14 LED1.1
$1N4272: length 3.2
  Top Layer w0.254: R15.2 16.71,18.97 17.02,18.67 17.02,18.03 17.4,17.65 U10.5
$1N4446: length 6.1
  Top Layer w0.254: 8.2,15.11 7.49,15.11 7.11,15.49 3.68,15.49 2.92,16.26 LED2.2
$1N4523: length 1.8
  Top Layer w0.254: R16.2 18.27,6.23 LED3.1

## Copper pours and planes (outline as drawn; the poured copper is in the pictures)
GND on Top Layer: 1.65,20.7 68.45,20.7 69.72,19.43 69.72,2.02 68,0.3 39.83,0.3 39.5,0.64 39.5,6.19 39.24,6.45 19.78,6.45 19.56,6.22 19.56,0.51 19.3,0.25 1.91,0.25 0.25,1.91 0.25,19.3
GND on Bottom Layer: 68.45,20.7 69.72,19.43 69.72,2.02 68,0.3 39.83,0.3 39.5,0.64 39.5,6.19 39.24,6.45 19.78,6.45 19.56,6.22 19.56,0.51 19.3,0.25 1.91,0.25 0.25,1.91 0.25,19.3 1.65,20.7

## Text on the board
Top Silkscreen Layer: BOOT | RST | GPS | ANT | BUTTON | LED
